# Altium schematic sheet H750Common5.SchDoc
size A3
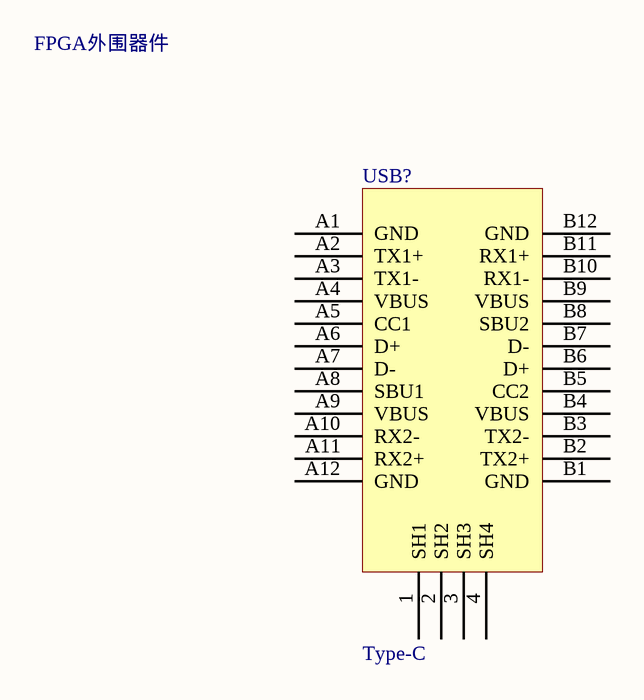
[diagram p0: H750Common5.SchDoc]

## Parts
USB?  Type-C  [Type-C]

## Nets

Not connected (* = marked no-connect by the designer): USB? 1(SH1) 2(SH2) 3(SH3) 4(SH4) A1(GND) A2(TX1+) A3(TX1-) A4(VBUS) A5(CC1) A6(D+) A7(D-) A8(SBU1) A9(VBUS) A10(RX2-) A11(RX2+) A12(GND) B1(GND) B2(TX2+) B3(TX2-) B4(VBUS) B5(CC2) B6(D+) B7(D-) B8(SBU2) B9(VBUS) B10(RX1-) B11(RX1+) B12(GND)

## Notes on the sheet
- FPGA外围器件